# Altium schematic sheet led_em_kian_220v_v2_RECTIFIRER&SIGNAL.SchDoc
size 381 x 241 mm
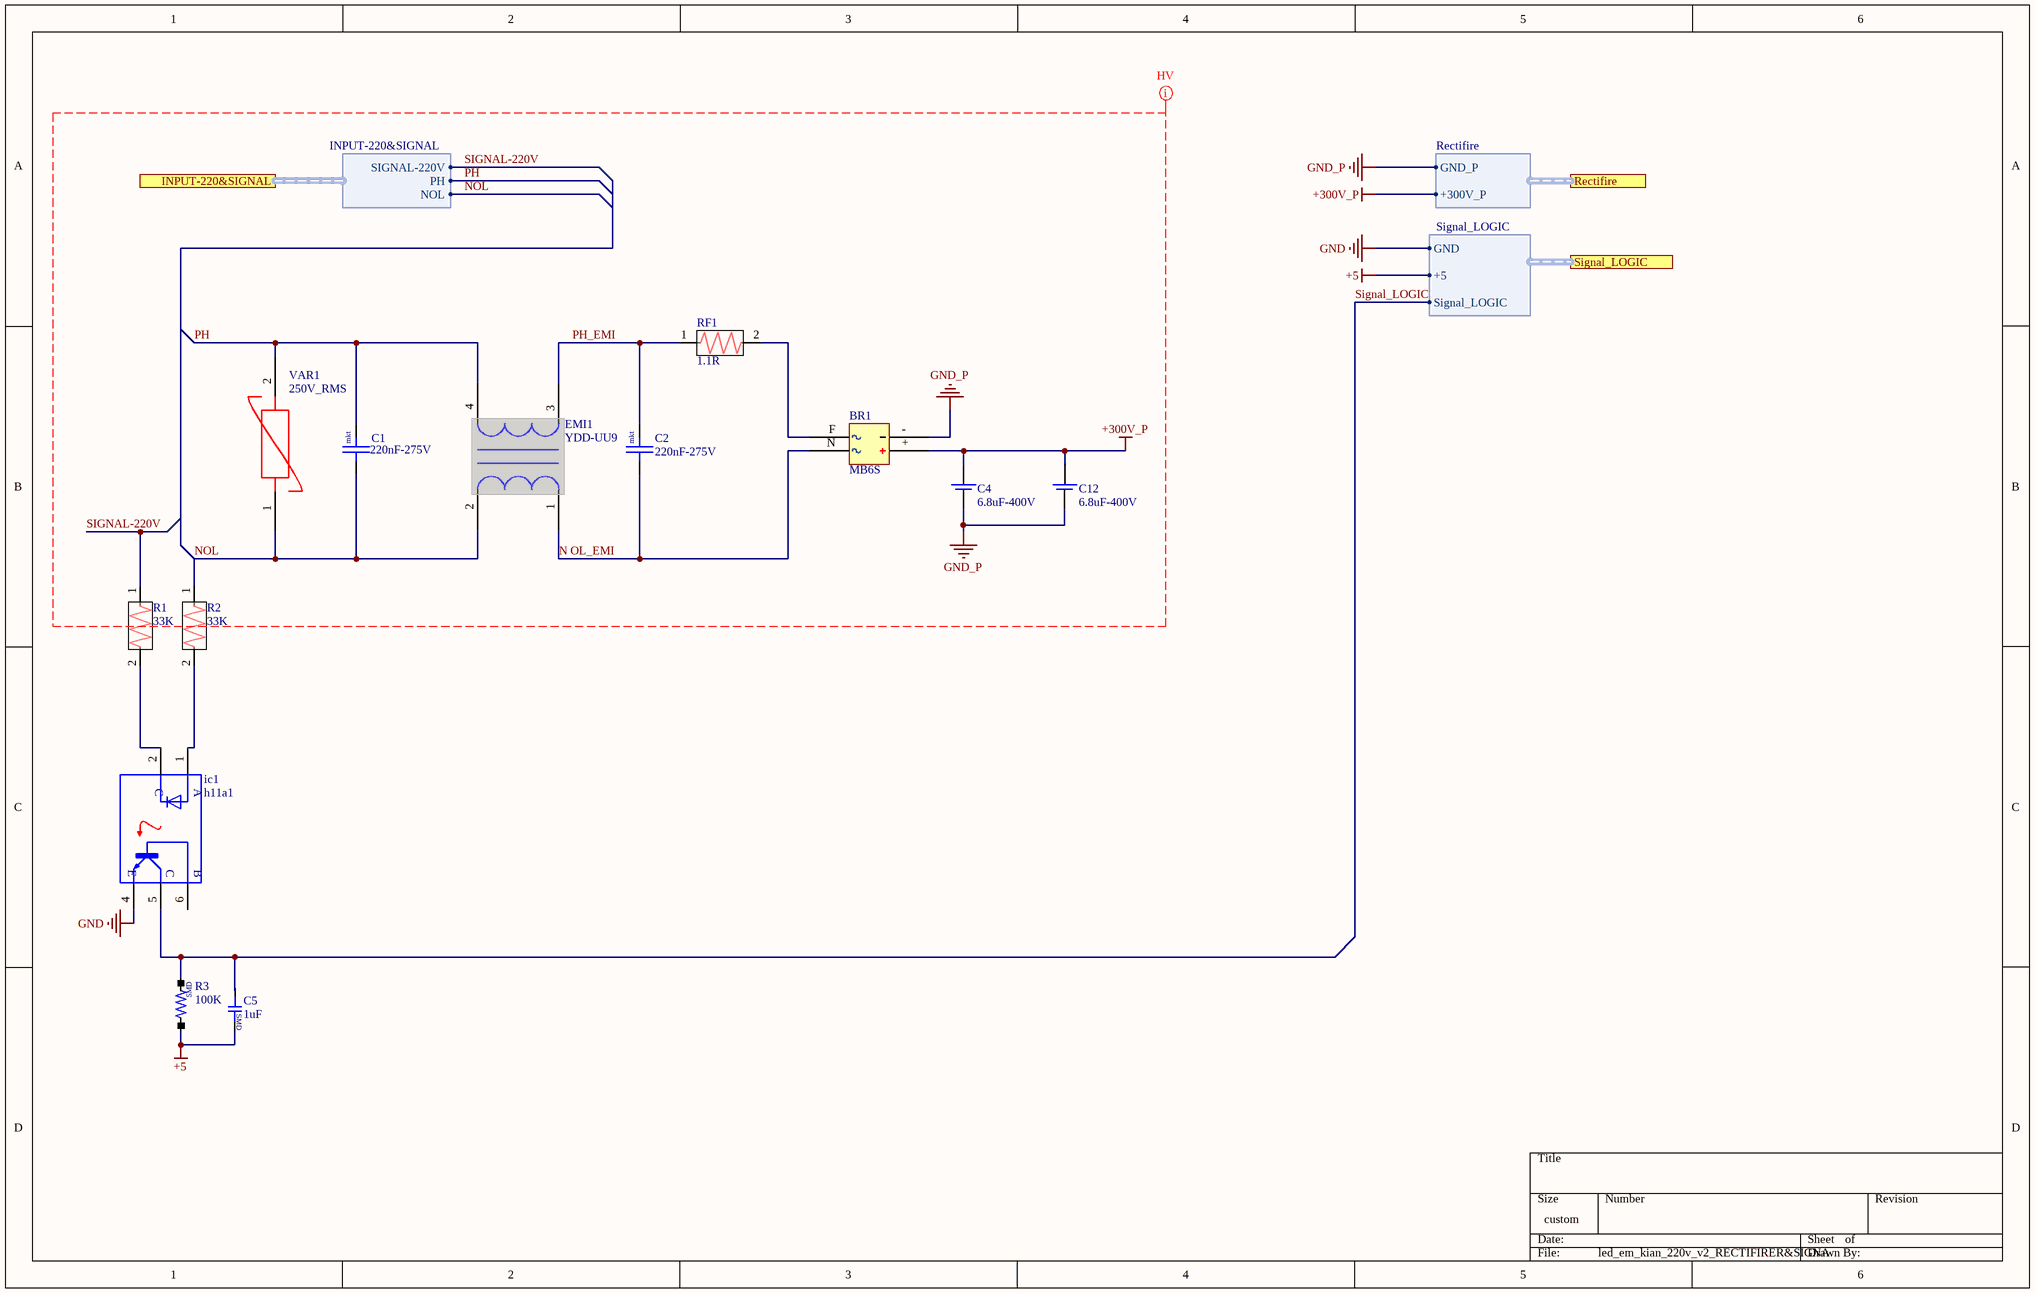
[diagram p0: led_em_kian_220v_v2_RECTIFIRER&SIGNAL.SchDoc]

## Parts
BR1  MB6S  [MB6S/SMD]
C1  220nF-275V  [CAP/0.22uF/275v/mkt]
C2  220nF-275V  [CAP/0.22uF/275v/mkt]
C4  6.8uF-400V  [CAP-EL_P5MM]
C5  1uF  [CAP-0805]
C12  6.8uF-400V  [CAP-EL_P5MM]
EMI1  YDD-UU9  [emi_chok_yd]
ic1  h11a1  [h11a1]
R1  33K  [RES/1W]
R2  33K  [RES/1W]
R3  100K  [RES/0805]
RF1  1.1R  [RES/1W]
VAR1  250V_RMS  [varistor]

## Ports
INPUT-220&SIGNAL (harness INPUT-220&SIGNAL), Rectifire (harness Rectifire), Signal_LOGIC (harness Signal_LOGIC)

## Harnesses
INPUT-220&SIGNAL: NOL, PH, SIGNAL-220V
Rectifire: GND_P, +300V_P
Signal_LOGIC: GND, +5, Signal_LOGIC

## Nets
+5: C5.2 R3.1 ; port Signal_LOGIC.+5
+300V_P: BR1.+ C4.+ C12.+ ; port Rectifire.+300V_P
GND: ic1.4(E) ; port Signal_LOGIC.GND
GND_P: BR1.- C4.- C12.- ; port Rectifire.GND_P
N OL_EMI: BR1.N C2.1 EMI1.1
NOL: C1.1 EMI1.2 R2.1 VAR1.1 ; port INPUT-220&SIGNAL.NOL
PH: C1.2 EMI1.4 VAR1.2 ; port INPUT-220&SIGNAL.PH
PH_EMI: C2.2 EMI1.3 RF1.1
SIGNAL-220V: R1.1 ; port INPUT-220&SIGNAL.SIGNAL-220V
Signal_LOGIC: C5.1 ic1.5(C`) R3.2 ; port Signal_LOGIC.Signal_LOGIC
NetBR1_F: BR1.F RF1.2
Netic1_1: ic1.1(A) R2.2
Netic1_2: ic1.2(C) R1.2

Not connected (* = marked no-connect by the designer): ic1 6(B)

## Layout directives
net class HV; Parameter 1: u: +300V_P, GND_P, N OL_EMI, NOL, PH, PH_EMI, SIGNAL-220V

## Notes on the sheet
- (in symbol cap-mkt) mkt
- (in symbol cap_smd) SMD
- (in symbol RES/SMD) SMD

## Library data of the parts
BR1 = BRIDGE RECTIFIERS/SMD
C1 C2 = cap-mkt
C4 C12 = cap-electrolit
C5 = cap_smd
EMI1 = emi_chok_yd
R1 R2 RF1 = RES/>=1W
R3 = RES/SMD
VAR1 = varistor